# Altium schematic sheet key_count.SchDoc
size A4
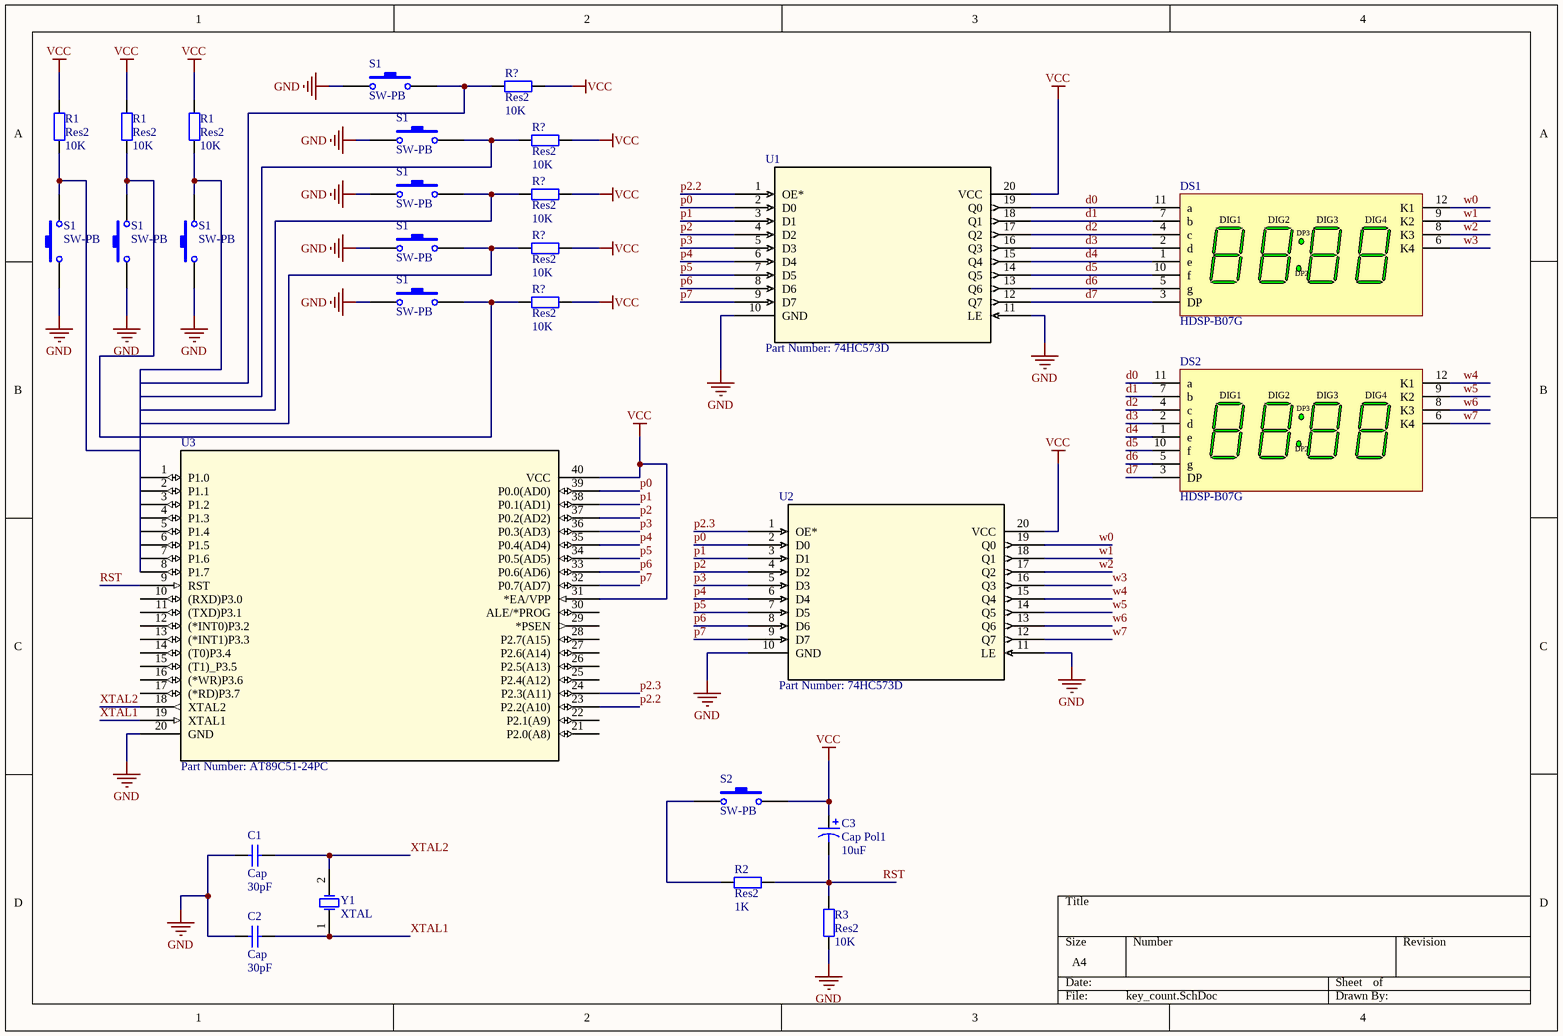
[diagram p0: key_count.SchDoc]

## Parts
(Parts that share a designator on the sheet are numbered #1, #2 ... from top to bottom, then left to right.)
C1  Cap  value 30pF  [RAD-0.3]
C2  Cap  value 30pF  [RAD-0.3]
C3  Cap Pol1  value 10uF  [RB7.6-15]
DS1  HDSP-B07G  [B-88]
DS2  HDSP-B07G  [B-88]
R1#1  Res2  value 10K  [AXIAL-0.4]
R1#2  Res2  value 10K  [AXIAL-0.4]
R1#3  Res2  value 10K  [AXIAL-0.4]
R2  Res2  value 1K  [AXIAL-0.4]
R3  Res2  value 10K  [AXIAL-0.4]
R?#1  Res2  value 10K  [AXIAL-0.4]
R?#2  Res2  value 10K  [AXIAL-0.4]
R?#3  Res2  value 10K  [AXIAL-0.4]
R?#4  Res2  value 10K  [AXIAL-0.4]
R?#5  Res2  value 10K  [AXIAL-0.4]
S1#1  SW-PB  [SPST-2]
S1#2  SW-PB  [SPST-2]
S1#3  SW-PB  [SPST-2]
S1#4  SW-PB  [SPST-2]
S1#5  SW-PB  [SPST-2]
S1#6  SW-PB  [SPST-2]
S1#7  SW-PB  [SPST-2]
S1#8  SW-PB  [SPST-2]
S2  SW-PB  [SPST-2]
U1  Part Number: 74HC573D  [SOT163-1]
U2  Part Number: 74HC573D  [SOT163-1]
U3  Part Number: AT89C51-24PC  [40P6]
Y1  XTAL  [R38]

## Nets
GND: C1.1 C2.1 R3.1 S1#1.1 S1#2.1 S1#3.1 S1#4.1 S1#5.1 S1#6.1 S1#7.1 S1#8.1 U1.10(GND) U1.11(LE) U2.10(GND) U2.11(LE) U3.20(GND)
VCC: C3.1 R1#1.2 R1#2.2 R1#3.2 R?#1.2 R?#2.2 R?#3.2 R?#4.2 R?#5.2 S2.2 U1.20(VCC) U2.20(VCC) U3.31(*EA/VPP) U3.40(VCC)
d0: DS1.11(a) DS2.11(a) U1.19(Q0)
d1: DS1.7(b) DS2.7(b) U1.18(Q1)
d2: DS1.4(c) DS2.4(c) U1.17(Q2)
d3: DS1.2(d) DS2.2(d) U1.16(Q3)
d4: DS1.1(e) DS2.1(e) U1.15(Q4)
d5: DS1.10(f) DS2.10(f) U1.14(Q5)
d6: DS1.5(g) DS2.5(g) U1.13(Q6)
d7: DS1.3(DP) DS2.3(DP) U1.12(Q7)
p0: U1.2(D0) U2.2(D0) U3.39(P0.0(AD0))
p1: U1.3(D1) U2.3(D1) U3.38(P0.1(AD1))
p2: U1.4(D2) U2.4(D2) U3.37(P0.2(AD2))
p2.2: U1.1(OE*) U3.23(P2.2(A10))
p2.3: U2.1(OE*) U3.24(P2.3(A11))
p3: U1.5(D3) U2.5(D3) U3.36(P0.3(AD3))
p4: U1.6(D4) U2.6(D4) U3.35(P0.4(AD4))
p5: U1.7(D5) U2.7(D5) U3.34(P0.5(AD5))
p6: U1.8(D6) U2.8(D6) U3.33(P0.6(AD6))
p7: U1.9(D7) U2.9(D7) U3.32(P0.7(AD7))
RST: C3.2 R2.2 R3.2 U3.9(RST)
w0: DS1.12(K1) U2.19(Q0)
w1: DS1.9(K2) U2.18(Q1)
w2: DS1.8(K3) U2.17(Q2)
w3: DS1.6(K4) U2.16(Q3)
w4: DS2.12(K1) U2.15(Q4)
w5: DS2.9(K2) U2.14(Q5)
w6: DS2.8(K3) U2.13(Q6)
w7: DS2.6(K4) U2.12(Q7)
XTAL1: C2.2 U3.19(XTAL1) Y1.1(OSC1)
XTAL2: C1.2 U3.18(XTAL2) Y1.2(OSC2)
NetR1#1_1: R1#1.1 S1#5.2
NetR1#2_1: R1#2.1 R?#5.1 S1#6.2 S1#8.2
NetR1#3_1: R1#3.1 S1#7.2
NetR2_1: R2.1 S2.1
NetR?#1_1: R?#1.1 S1#1.2
NetR?#2_1: R?#2.1 S1#2.2
NetR?#3_1: R?#3.1 S1#3.2
NetR?#4_1: R?#4.1 S1#4.2

Not connected (* = marked no-connect by the designer): U3 1(P1.0) 2(P1.1) 3(P1.2) 4(P1.3) 5(P1.4) 6(P1.5) 7(P1.6) 8(P1.7) 10((RXD)P3.0) 11((TXD)P3.1) 12((*INT0)P3.2) 13((*INT1)P3.3) 14((T0)P3.4) 15((T1)_P3.5) 16((*WR)P3.6) 17((*RD)P3.7) 21(P2.0(A8)) 22(P2.1(A9)) 25(P2.4(A12)) 26(P2.5(A13)) 27(P2.6(A14)) 28(P2.7(A15)) 29(*PSEN) 30(ALE/*PROG)

## Notes on the sheet
- (in symbol HDSP-B07G) DIG1; DIG2; DIG3; DIG4; DP3; DP2

## Library data of the parts
C1 C2 = Cap: Capacitor; Published: 8-Jun-2000; LatestRevisionDate: 17-Jul-2002; LatestRevisionNote: Re-released for DXP Platform.; PackageReference: RAD-0.3; Publisher: Altium Limited; PackageDescription: Radial Cap, Thru-Hole; 2 Leads; 0.3 in Pin Spacing
C3 = Cap Pol1: Polarized Capacitor (Radial); Published: 8-Jun-2000; LatestRevisionDate: 17-Jul-2002; LatestRevisionNote: Re-released for DXP Platform.; PackageReference: RB7.6-15; Publisher: Altium Limited; PackageDescription: Polarized Capacitor (Radial); 2 Leads
DS1 DS2 = HDSP-B07G: 14.22 mm Untinted, 88:88 4-Digit 7-Segment Display: CC, Gray Surface; LuminousIntensity: 3200 ucd (Minimum).; LED_Colour: Green; Published: 26-May-2004; LatestRevisionDate: 11-Oct-2004; LatestRevisionNote: Display outline superimposed on PCB Footprint.; DatasheetVersion: 23-Sep-2002; PackageVersion: 21-Aug-2001; PackageReference: B-88; Publisher: Altium Limited; PackageDescription: LED, 7-Segment Display, 14.22 mm, Four Digit, 88:88; 12 Leads; Row Space 15.24 mm; Pitch 2.54 mm; ComponentLink1Description: Manufacturer Link; ComponentLink1URL: http://www.agilent.com/; ComponentLink2Description: Datasheet; ComponentLink2URL: http://cp.literature.agilent.com/litweb/pdf/5988-7859EN.pdf
R1#1-R1#3 R2 R3 R?#1-R?#5 = Res2: Resistor; Published: 8-Jun-2000; LatestRevisionDate: 17-Jul-2002; LatestRevisionNote: Re-released for DXP Platform.; PackageReference: AXIAL-0.4; Publisher: Altium Limited; PackageDescription: Axial Device, Thru-Hole; 2 Leads; 0.4 in Pin Spacing
S1#1-S1#8 S2 = SW-PB: Switch; Published: 24-Mar-1999; LatestRevisionDate: 17-Jul-2002; LatestRevisionNote: Re-released for DXP Platform.; PackageReference: SPST-2; Publisher: Altium Limited; PackageDescription: Switch; 2 Leads
U1 U2 = 74HC573D: No Description Available; Vendor: Nexperia; Manufacturer_Part_Number: 74HC573D; Copyright: Copyright (C) 2016 Accelerated Designs. All rights reserved; RefDes: RefDes; Type: DEV; Value: Value
U3 = AT89C51-24PC: No Description Available; VENDOR: Atmel; Built_By: EMA_UL_Team; MANUFACTURER_PART_NUMBER: AT89C51-24PC; Copyright: Copyright (C) 2018 Accelerated Designs. All rights reserved; RefDes: RefDes; Type: DEV; Value: Value
Y1 = XTAL: Crystal Oscillator; Published: 8-Jun-2000; LatestRevisionDate: 17-Jul-2002; LatestRevisionNote: Re-released for DXP Platform.; PackageReference: R38; Publisher: Altium Limited; PackageDescription: Crystal, Thru-Hole; 2 Leads; Body 3.1 x 8.2 mm (Dia.xH)